# Altium schematic sheet Transmitter.SchDoc
size A4
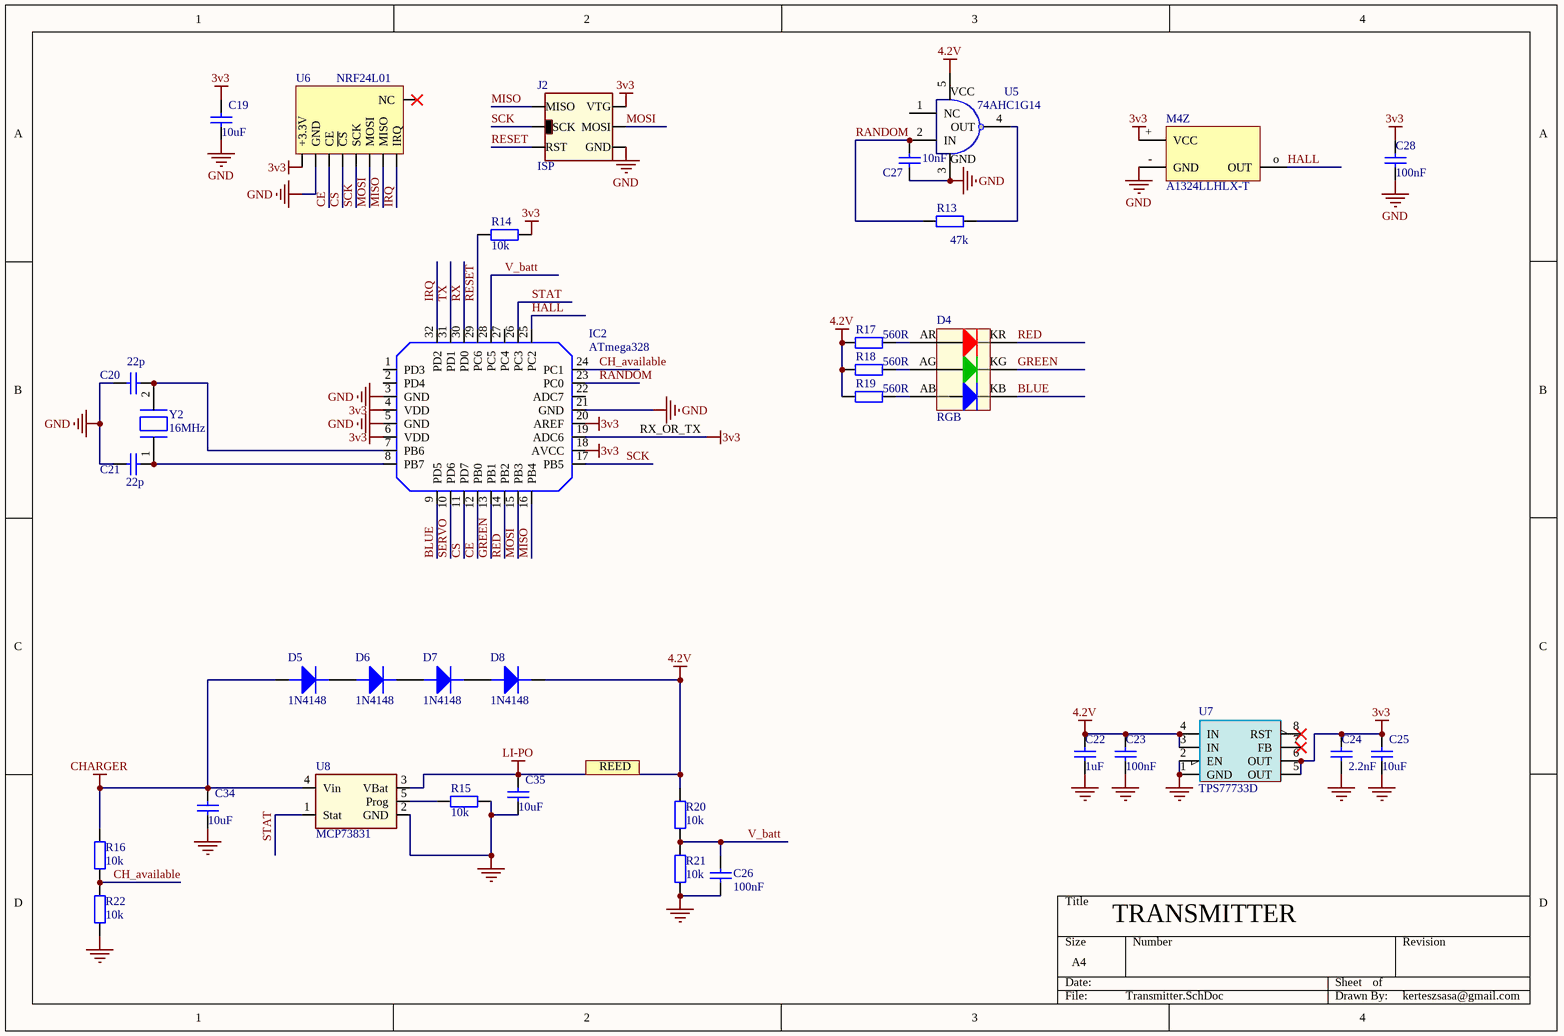
[diagram p0: Transmitter.SchDoc]

## Parts
C19  10uF  [FP_0603_CAP_080]
C20  22p  [FP_0603_CAP_080]
C21  22p  [FP_0603_CAP_080]
C22  1uF  [FP_0603_CAP_080]
C23  100nF  [FP_0603_CAP_080]
C24  2.2nF  [FP_0603_CAP_080]
C25  10uF  [FP_0603_CAP_080]
C26  100nF  [FP_0603_CAP_080]
C27  10nF  [FP_0603_CAP_080]
C28  100nF  [FP_0603_CAP_080]
C34  10uF  [FP_0603_CAP_080]
C35  10uF  [FP_0603_CAP_080]
D4  RGB  [RGB_LED_5.0x5.0mm]
D5  1N4148  [SOD-80]
D6  1N4148  [SOD-80]
D7  1N4148  [SOD-80]
D8  1N4148  [SOD-80]
IC2  ATmega328  [TQFP32_N]
J2  ISP  [AVR_ISP]  (no BOM)
M4Z  A1324LLHLX-T  [Sensoe_hall_SOT23]
R13  47k  [FP_0603_RES]
R14  10k  [FP_0603_RES]
R15  10k  [FP_0603_RES]
R16  10k  [FP_0603_RES]
R17  560R  [FP_0603_RES]
R18  560R  [FP_0603_RES]
R19  560R  [FP_0603_RES]
R20  10k  [FP_0603_RES]
R21  10k  [FP_0603_RES]
R22  10k  [FP_0603_RES]
U5  74AHC1G14  [GATE_SOT23-5]
U6  NRF24L01  [NRF24L01_SMD]
U7  TPS77733D  [DIGITAL_SOIC8]
U8  MCP73831  [SUPPLY_SOT23-5]
Y2  16MHz  [FP_CRYSTAL_HC49_SMD]

## Nets
3v3: C19.2 C24.2 C25.2 C28.2 IC2.4(VDD) IC2.6(VDD) IC2.18(AVCC) IC2.19(ADC6) IC2.20(AREF) J2.2(VTG) M4Z.+(VCC) R14.2 U6.1(+3.3V) U7.5(OUT) U7.6(OUT)
4.2V: C22.2 C23.2 D8.K R17.2 R18.2 R19.2 R20.2 U5.5(VCC) U7.3(IN) U7.4(IN)
CHARGER: C34.2 D5.A R16.2 U8.4(Vin)
GND: C19.1 C20.1 C21.1 C22.1 C23.1 C24.1 C25.1 C26.2 C27.1 C28.1 C34.1 C35.1 IC2.3(GND) IC2.5(GND) IC2.21(GND) J2.6(GND) M4Z.-(GND) R15.1 R21.1 R22.1 U5.3(GND) U6.2(GND) U7.1(GND) U7.2(EN) U8.2(GND)
LI-PO: C35.2 U8.3(VBat)
BLUE: D4.KB(R) IC2.9(PD5)
CE: IC2.12(PB0) U6.3(CE)
CH_available: IC2.24(PC1) R16.1 R22.2
CS: IC2.11(PD7) U6.4(~{CS})
GREEN: D4.KG(G) IC2.13(PB1)
HALL: IC2.25(PC2) M4Z.o(OUT)
IRQ: IC2.32(PD2) U6.8(IRQ)
MISO: IC2.16(PB4) J2.1(MISO) U6.7(MISO)
MOSI: IC2.15(PB3) J2.4(MOSI) U6.6(MOSI)
RANDOM: C27.2 IC2.23(PC0) R13.2 U5.2(IN)
RED: D4.KR(B) IC2.14(PB2)
RESET: IC2.29(PC6) J2.5(RST) R14.1
RX: IC2.30(PD0)
SCK: IC2.17(PB5) J2.3(SCK) U6.5(SCK)
SERVO: IC2.10(PD6)
STAT: IC2.26(PC3) U8.1(Stat)
TX: IC2.31(PD1)
V_batt: C26.1 IC2.28(PC5) R20.1 R21.2
NetC20_2: C20.2 IC2.7(PB6) Y2.2
NetC21_2: C21.2 IC2.8(PB7) Y2.1
NetD4_AB: D4.AB(A) R19.1
NetD4_AG: D4.AG(A) R18.1
NetD4_AR: D4.AR(A) R17.1
NetD5_K: D5.K D6.A
NetD6_K: D6.K D7.A
NetD7_K: D7.K D8.A
NetR13_1: R13.1 U5.4(OUT)
NetR15_2: R15.2 U8.5(Prog)

Not connected (* = marked no-connect by the designer): IC2 1(PD3) 2(PD4) 22(ADC7) 27(PC4); U5 1(NC); U6 9(NC)*; U7 7(FB)* 8(RST)*

## Notes on the sheet
- RX_OR_TX
- REED
- TRANSMITTER
- kerteszsasa@gmail.com

## Library data of the parts
C19-C28 C34 C35 = Cap: Capacitor; Leírás: Capacitor ceramic X7R
  C19 C25 C34 C35: Value: 10uF; Order info: 82-07-81
  C20 C21: Value: 22p; Order info: 82-02-18
  C22: Order info: 82-08-08; Value: 1uF
  C23 C28: Value: 100nF; Order info: 82-04-85
  C24: Value: 2.2nF; Order info: 82-02-41
  C26: Value: 100nF; Order info: 82-06-23
  C27: Value: 10nF; Order info: 82-07-81
D4 = LED_RGB_6_PIN: Leírás: RGB led; Order info: 95-02-90
D5-D8 = DIODE_big: Diode 1N4148 SMD; Order info: 83-01-06; Leírás: Diode 1N4148 SMD
J2 = ISP: Programozó csatlakozó; Order info: nem kell; Leírás: Programozó csatlakozó
M4Z = A3122EUA: Hall-Effect Switch for High-Temperature Operation; Leírás: HALL sensor; Order info: http://hu.mouser.com/ProductDetail/Texas-Instruments/DRV5053RAQDBZRQ1/?qs=sGAEpiMZZMvhQj7WZhFIAKr4ZLpH%2fvGa8o%2fNpWWMhmTwb2ZevLC2RA%3d%3d
R13-R22 = Res3: Resistor; Leírás: Resistor
  R13: Value: 47k; Order info: 81-10-46
  R14-R16 R20-R22: Value: 10k; Order info: 80-11-68
  R17-R19: Value: 560R; Order info: 81-04-19
U5 = 74AHC1G14: SCHMITT-TRIGGER INVERTER; Leírás: Inverter gate; Order info: 87-03-90
U6 = NRF24L01: 2.4Ghz RF module; Leírás: 2.4GHz RF module; Order info: http://www.ebay.com/itm/Mini-NRF24L01-SMD-1-27MM-wireless-transceiver-module-Small-Size/321938267213?_trksid=p2047675.c100005.m1851&_trkparms=aid%3D222007%26algo%3DSIC.MBE%26ao%3D1%26asc%3D20131003132420%26meid%3D79cec08809324ce588edcca11bd960b9%26pid%3D100005%26rk%3D2%26rkt%3D6%26sd%3D131725655413
U7 = TPS77733D: LDO Voltage Regulators Fast-Tran-Res 750-mA; Order info: http://hu.mouser.com/ProductDetail/Texas-Instruments/TPS77733D/?qs=sGAEpiMZZMsGz1a6aV8DcPXeWoVS0FnzzBFSSaOk9hM%3d; Leírás: LDO Voltage Regulators Fast-Tran-Res 750-mA
U8 = MCP73831: MCP73831 SOT23-5 Li-on batt charger; Leírás: LIPO charger; Order info: http://hu.mouser.com/ProductDetail/Microchip-Technology/MCP73831T-2ACI-OT/?qs=sGAEpiMZZMsfD%252bbMpEGFJbfJoD52oiVFLoHG0qn9uiA%3d
Y2 = XTAL HC49: Standard HC49 quartz; Leírás: 16MHz Quartz HC49; Value: 16MHz; Order info: 40-01-26
IC2 = ATmega328: Order info: http://hu.mouser.com/Semiconductors/Embedded-Processors-Controllers/Microcontrollers-MCU/8-bit-Microcontrollers-MCU/_/N-a85ik?P=1z0y146&Keyword=atmega328&FS=True&Ns=Pricing|0; Leírás: ATmega328